# Altium schematic sheet I_O.SchDoc
size 250 x 250 mm; SheetNumber: 9; SheetTotal: 13
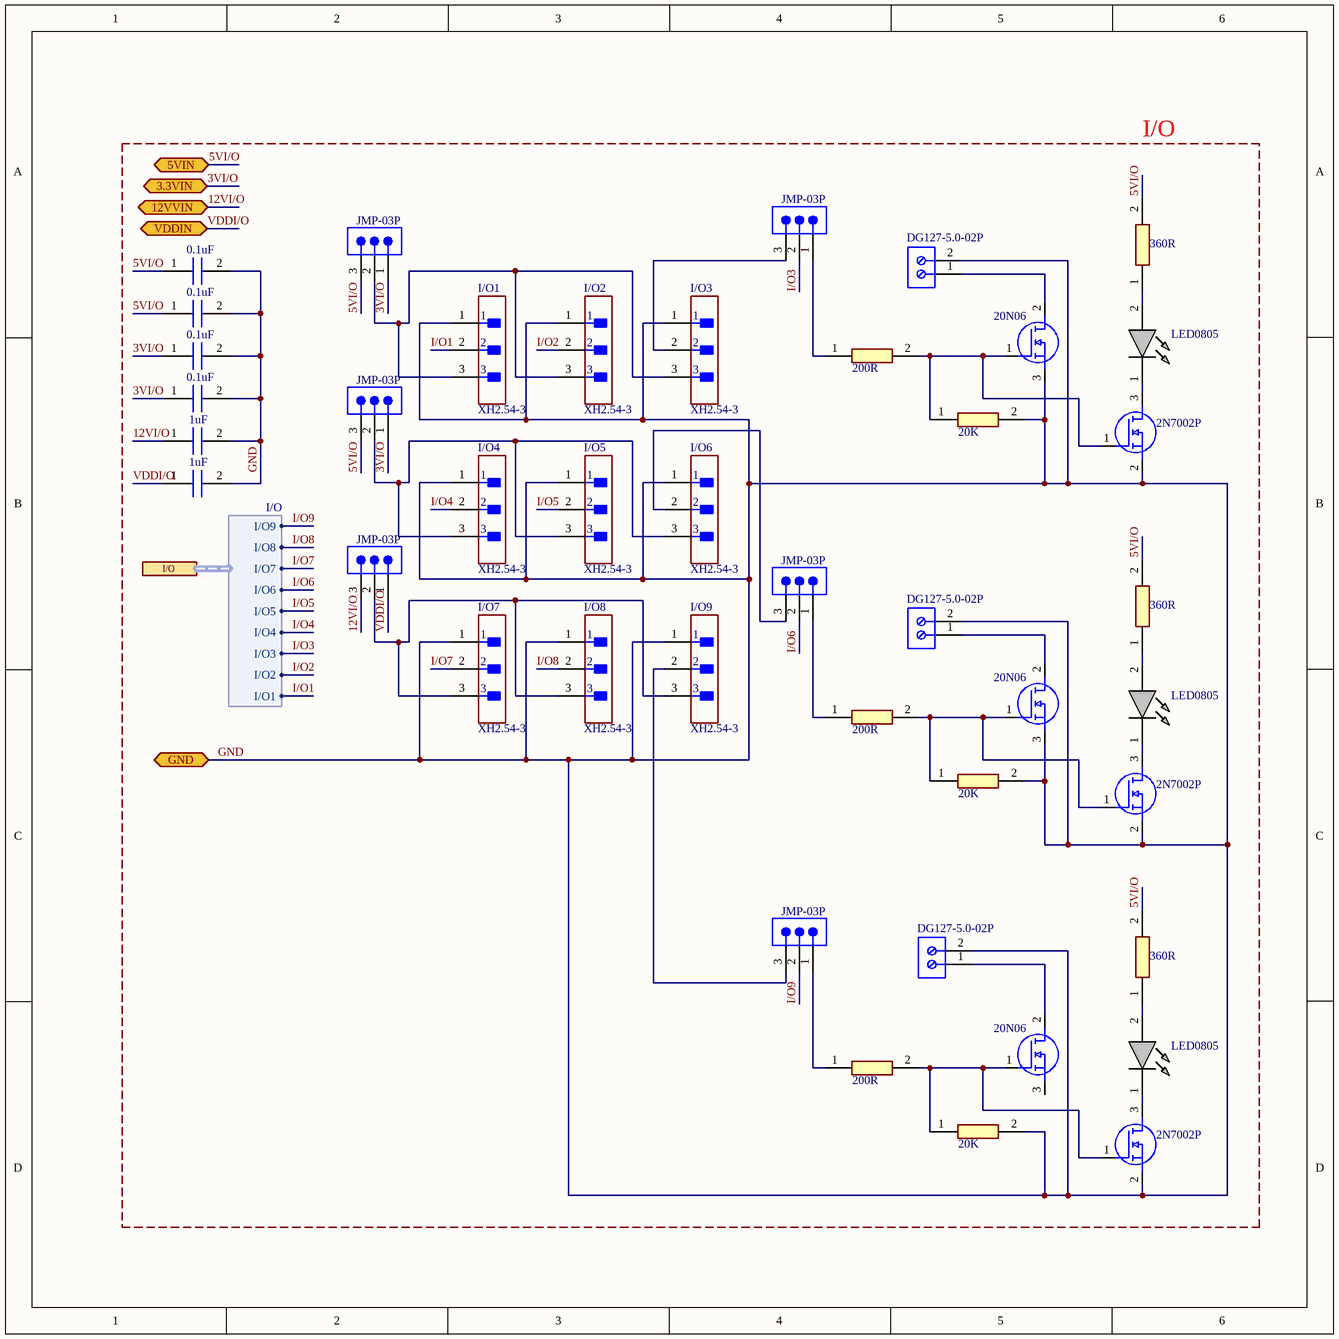
[diagram p0: I_O.SchDoc]

## Parts
CAP3VI/O1  0.1uF  [CAP0805]
CAP3VI/O2  0.1uF  [CAP0805]
CAP5VI/O1  0.1uF  [CAP0805]
CAP5VI/O2  0.1uF  [CAP0805]
CAP12VI/O  1uF  [К10-17Б]
CAPVDDI/O  1uF  [К10-17Б]
I/O1  XH2.54-3  [XH2.54-3]
I/O2  XH2.54-3  [XH2.54-3]
I/O3  XH2.54-3  [XH2.54-3]
I/O4  XH2.54-3  [XH2.54-3]
I/O5  XH2.54-3  [XH2.54-3]
I/O6  XH2.54-3  [XH2.54-3]
I/O7  XH2.54-3  [XH2.54-3]
I/O8  XH2.54-3  [XH2.54-3]
I/O9  XH2.54-3  [XH2.54-3]
JMPI/O1  JMP-03P  [JMP-03P]
JMPI/O2  JMP-03P  [JMP-03P]
JMPI/O3  JMP-03P  [JMP-03P]
JMPI/O3HIGH  JMP-03P  [JMP-03P]
JMPI/O6  JMP-03P  [JMP-03P]
JMPI/O9  JMP-03P  [JMP-03P]
LED3(GREEN)  LED0805  [LED0805]
LED6(GREEN)  LED0805  [LED0805]
LED9(GREEN)  LED0805  [LED0805]
M1  2N7002P  [2N7002P]
M6  2N7002P  [2N7002P]
M9  2N7002P  [2N7002P]
MS1  20N06  [20N06]
MS6  20N06  [20N06]
MS9  20N06  [20N06]
OUT3  DG127-5.0-02P  [DG127-5.0-02P]
OUT6  DG127-5.0-02P  [DG127-5.0-02P]
OUT9  DG127-5.0-02P  [DG127-5.0-02P]
RES1  200R  [RES0805]
RES2  20K  [RES0805]
RES3  360R  [RES0805]
RES4  200R  [RES0805]
RES5  20K  [RES0805]
RES6  360R  [RES0805]
RES7  200R  [RES0805]
RES8  20K  [RES0805]
RES9  360R  [RES0805]

## Blocks framed on the sheet
I/O: CAP3VI/O1 CAP3VI/O2 CAP5VI/O1 CAP5VI/O2 CAP12VI/O CAPVDDI/O I/O1-I/O9 JMPI/O1-JMPI/O3 JMPI/O3HIGH JMPI/O6 JMPI/O9 LED3(GREEN) LED6(GREEN) LED9(GREEN) M1 M6 M9 MS1 MS6 MS9 OUT3 OUT6 OUT9 RES1-RES9

## Ports
3.3VIN (bidir, see CONTROL_PCB_MAIN[3B], ADC1[2B], I2C[2A], MOTORS[2B], RELAY_5V_3.3V_LEVEL[3B], SPI[1A], UARTSTM[2A]), 5VIN (bidir, see CONTROL_PCB_MAIN[3B], ADC1[2B], I2C[2A], LEDS[1A], MOTORS[2B], RELAY_5V_3.3V_LEVEL[3B], SPI[1A], UARTSTM[2A]), 12VVIN (bidir, see CONTROL_PCB_MAIN[3B], RELAY_12VV_VDD_LEVEL[3B]), GND (bidir, see CONTROL_PCB_MAIN[3B], ADC1[2D], CAN[2C], I2C[2D], LEDS[1D], MOTORS[2D], RELAY_5V_3.3V_LEVEL[5C], RELAY_12VV_VDD_LEVEL[5B], SPI[1D], STM32[1D], UARTSTM[2D]), I/O (harness I/O, see CONTROL_PCB_MAIN[3B], STM32[3A]), VDDIN (bidir, see CONTROL_PCB_MAIN[3B], RELAY_12VV_VDD_LEVEL[3B])

## Harnesses
I/O: I/O1, I/O2, I/O3, I/O4, I/O5, I/O6, I/O7, I/O8, I/O9

## Nets
3VI/O: CAP3VI/O1.1 CAP3VI/O2.1 JMPI/O1.1 JMPI/O2.1 ; port 3.3VIN
5VI/O: CAP5VI/O1.1 CAP5VI/O2.1 JMPI/O1.3 JMPI/O2.3 RES3.2 RES6.2 RES9.2 ; port 5VIN
12VI/O: CAP12VI/O.1 JMPI/O3.3 ; port 12VVIN
GND: CAP3VI/O1.2 CAP3VI/O2.2 CAP5VI/O1.2 CAP5VI/O2.2 CAP12VI/O.2 CAPVDDI/O.2 I/O1.1 I/O2.1 I/O3.1 I/O4.1 I/O5.1 I/O6.1 I/O7.1 I/O8.1 I/O9.1 M1.2(S) M6.2(S) M9.2(S) MS1.3(S) MS6.3(S) OUT3.2 OUT6.2 OUT9.2 RES2.2 RES5.2 RES8.2 ; port GND
I/O1: I/O1.2 ; port I/O.I/O1
I/O2: I/O2.2 ; port I/O.I/O2
I/O3: JMPI/O3HIGH.2 ; port I/O.I/O3
I/O4: I/O4.2 ; port I/O.I/O4
I/O5: I/O5.2 ; port I/O.I/O5
I/O6: JMPI/O6.2 ; port I/O.I/O6
I/O7: I/O7.2 ; port I/O.I/O7
I/O8: I/O8.2 ; port I/O.I/O8
I/O9: JMPI/O9.2 ; port I/O.I/O9
VDDI/O: CAPVDDI/O.1 JMPI/O3.1 ; port VDDIN
NetI/O1_3: I/O1.3 I/O2.3 I/O3.3 JMPI/O1.2
NetI/O3_2: I/O3.2 JMPI/O3HIGH.3
NetI/O4_3: I/O4.3 I/O5.3 I/O6.3 JMPI/O2.2
NetI/O6_2: I/O6.2 JMPI/O6.3
NetI/O7_3: I/O7.3 I/O8.3 I/O9.3 JMPI/O3.2
NetI/O9_2: I/O9.2 JMPI/O9.3
NetJMPI/O3HIGH_1: JMPI/O3HIGH.1 RES1.1
NetJMPI/O6_1: JMPI/O6.1 RES4.1
NetJMPI/O9_1: JMPI/O9.1 RES7.1
NetLED3(GREEN)_1: LED3(GREEN).1(K) M1.3(D)
NetLED3(GREEN)_2: LED3(GREEN).2(A) RES3.1
NetLED6(GREEN)_1: LED6(GREEN).1(K) M6.3(D)
NetLED6(GREEN)_2: LED6(GREEN).2(A) RES6.1
NetLED9(GREEN)_1: LED9(GREEN).1(K) M9.3(D)
NetLED9(GREEN)_2: LED9(GREEN).2(A) RES9.1
NetM1_1: M1.1(G) MS1.1(G) RES1.2 RES2.1
NetM6_1: M6.1(G) MS6.1(G) RES4.2 RES5.1
NetM9_1: M9.1(G) MS9.1(G) RES7.2 RES8.1
NetMS1_2: MS1.2(D) OUT3.1
NetMS6_2: MS6.2(D) OUT6.1
NetMS9_2: MS9.2(D) OUT9.1

Not connected (* = marked no-connect by the designer): MS9 3(S)

## Library data of the parts
CAP3VI/O1 CAP3VI/O2 CAP5VI/O1 CAP5VI/O2 = CAP0805: CAP-SMD0805
CAP12VI/O CAPVDDI/O = CAP: К10-17Б
I/O1-I/O9 = XH2.54-3: JST XH2.54-3pin
JMPI/O1-JMPI/O3 JMPI/O3HIGH JMPI/O6 JMPI/O9 = JMP-03P: PLS-1x3
LED3(GREEN) LED6(GREEN) LED9(GREEN) = LED0805: LED-SMD0805
M1 M6 M9 = 2N7002P: 2N7002P,215
MS1 MS6 MS9 = 20N06: NMOSFET-20N06
OUT3 OUT6 OUT9 = DG127-5.0-02P: DG127-5.0-02P-14-00Z
RES1-RES9 = RES0805: RES-SMD0805